# EAGLE design Protoboard (EAGLE 6.5.0)
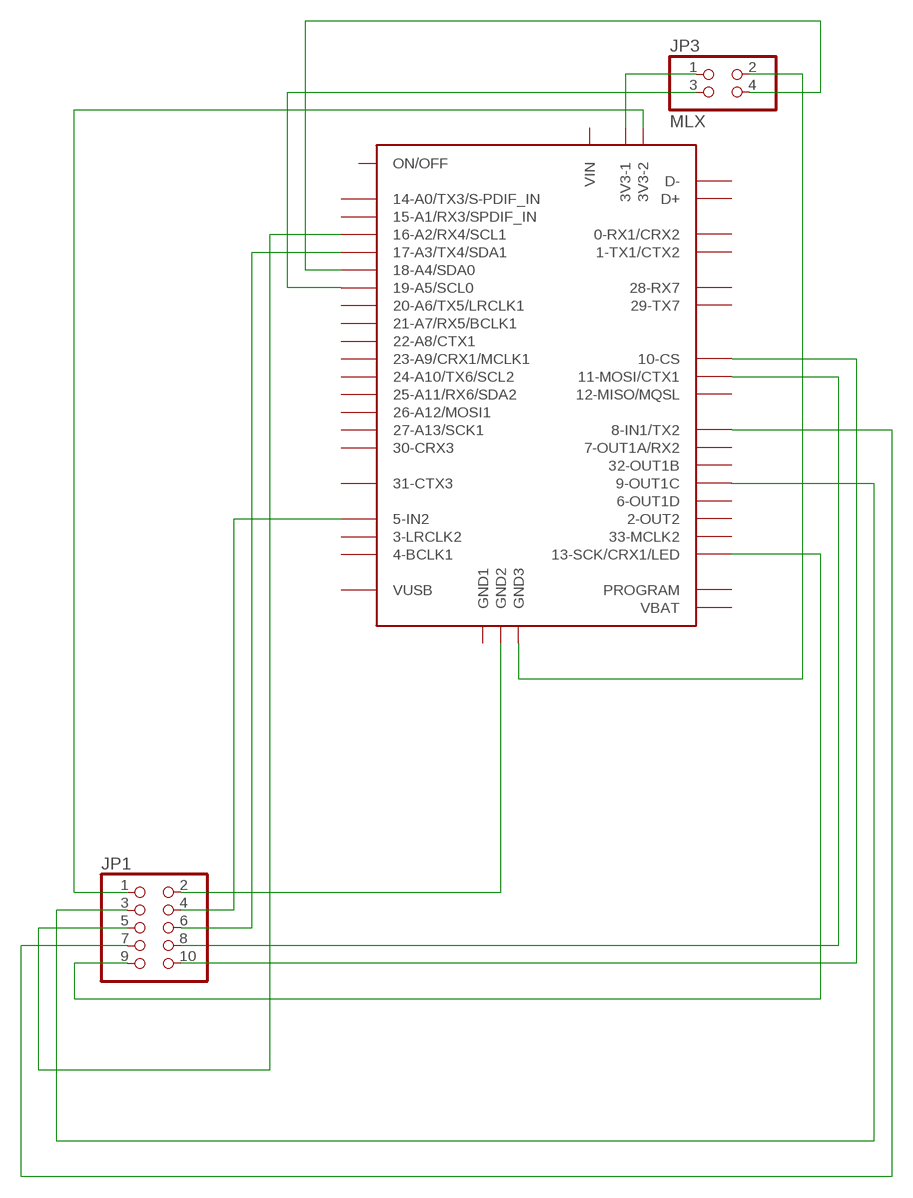
[diagram p0: schematic, sheet 1]

## Parts
JP1  PINHD-2X5  [2X05]
JP3  MLX  PINHD-2X2  [2X02]
U$1  TEENSY40  [TEENSY40]

## Nets
N$1: JP1.2 U$1.GND2
N$2: JP1.1 U$1.3V3-2
N$3: JP3.1 U$1.3V3-1
N$4: JP1.9 U$1.13-SCK/CRX1/LED
N$5: JP3.2 U$1.GND3
N$6: JP1.7 U$1.8-TX2/IN1(8-IN1/TX2)
N$7: JP1.5 U$1.16-A2/RX4/SCL1
N$8: JP1.6 U$1.17-A3/TX4/SDA1
N$10: JP1.4 U$1.5-IN2
N$11: JP1.8 U$1.11-MOSI/CTX1
N$12: JP1.10 U$1.10-CS/MQSR(10-CS)
N$13: JP3.4 U$1.18-A4/SDA0
N$14: JP3.3 U$1.19-A5/SCL0
N$15: JP1.3 U$1.9-OUT1C
Unconnected: U$1.0-RX1(0-RX1/CRX2) U$1.1-TX1(1-TX1/CTX2) U$1.2-OUT2 U$1.3-LRCLK2 U$1.4-BCLK2(4-BCLK1) U$1.6-OUT1D U$1.7-RX2/OUT1A(7-OUT1A/RX2) U$1.12-MIO/MQSL(12-MISO/MQSL) U$1.14-A0/TX3/S-PFI_OUT(14-A0/TX3/S-PDIF_IN) U$1.15-A1/RX3/S-PDIF_IN(15-A1/RX3/SPDIF_IN) U$1.20-A6/TX5/LRCLK1 U$1.21-A7/RX5/BCLK1 U$1.22-A8/CTX1 U$1.23-A9/CRX1/CCLK1(23-A9/CRX1/MCLK1) U$1.24-A10/TX6/SCL2 U$1.25-A11/SDA2(25-A11/RX6/SDA2) U$1.26-A12/MOSI1 U$1.27-A13/SCK1 U$1.28-RX7 U$1.29-TX7 U$1.30-CRX3 U$1.31-CTX3 U$1.32-OUTB1(32-OUT1B) U$1.33-MCLK2 U$1.D+ U$1.D- U$1.GND1 U$1.ON/OFF U$1.PROGRAM U$1.VBAT U$1.VIN U$1.VUSB

## Library data of the parts
JP1 = pinhead:PINHD-2X5: PIN HEADER
JP3 = pinhead:PINHD-2X2: PIN HEADER
U$1 = teensy:TEENSY40: Teensy 4.0 device including POGO pins for pins 24 - 33, but not yet pins for D+ and D-. Symbol layout is what works for me and may not suite everyone... that can be added or additional symbols can be created to be used in a modilied davie name.

## Board
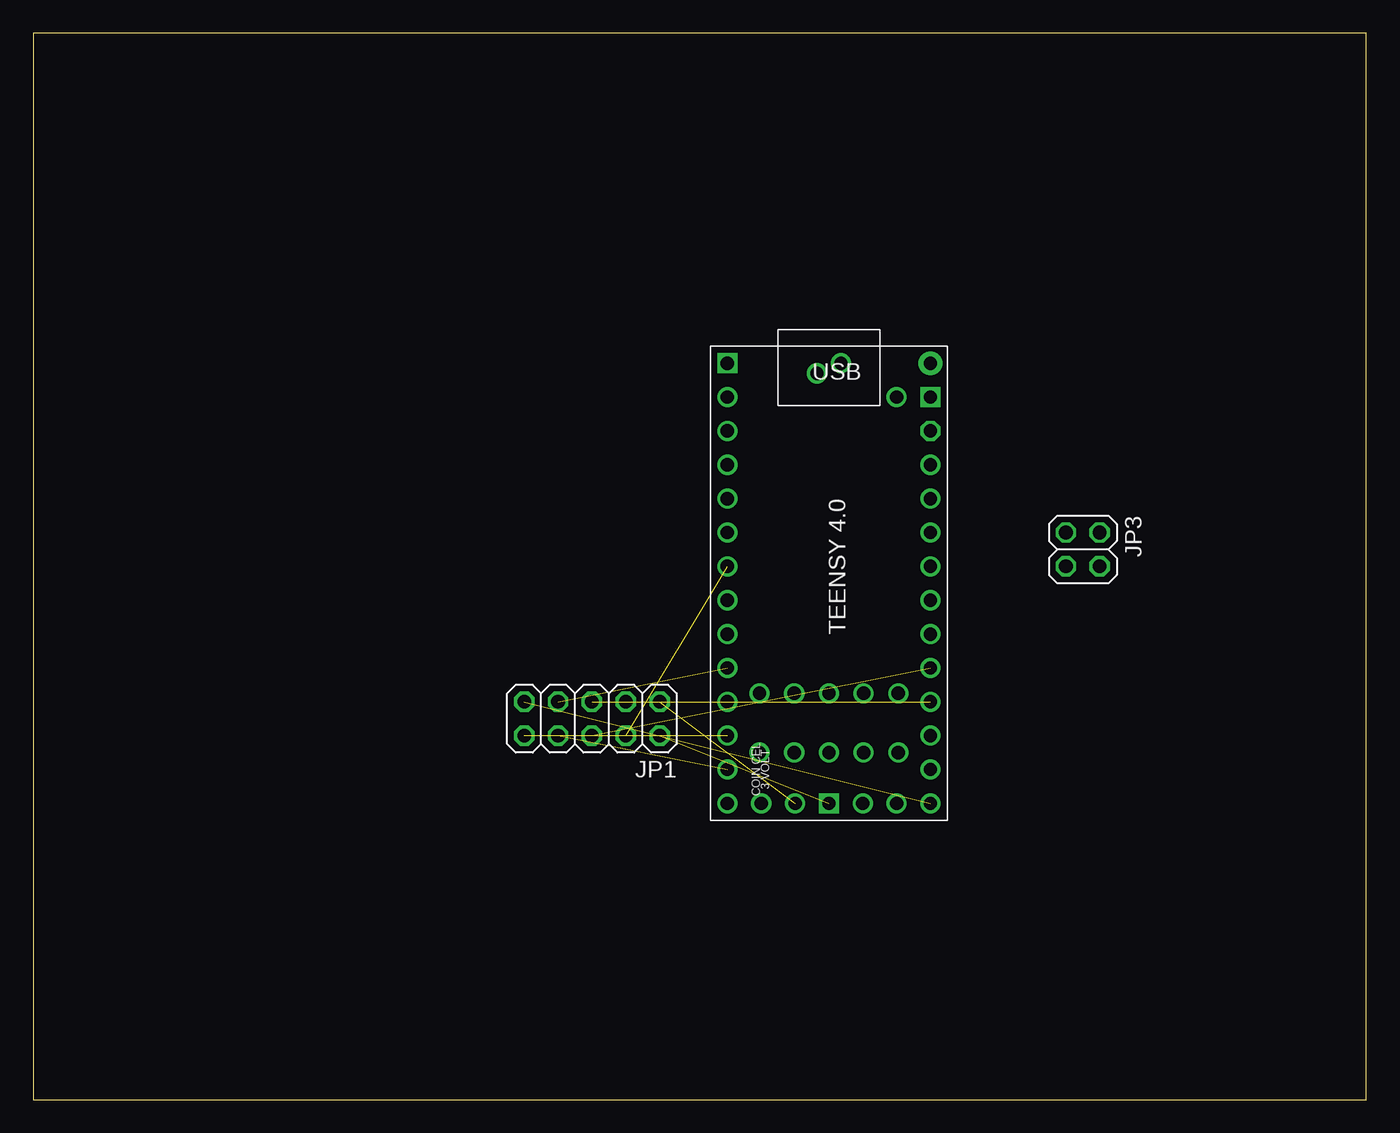
[diagram p1: board, top side]
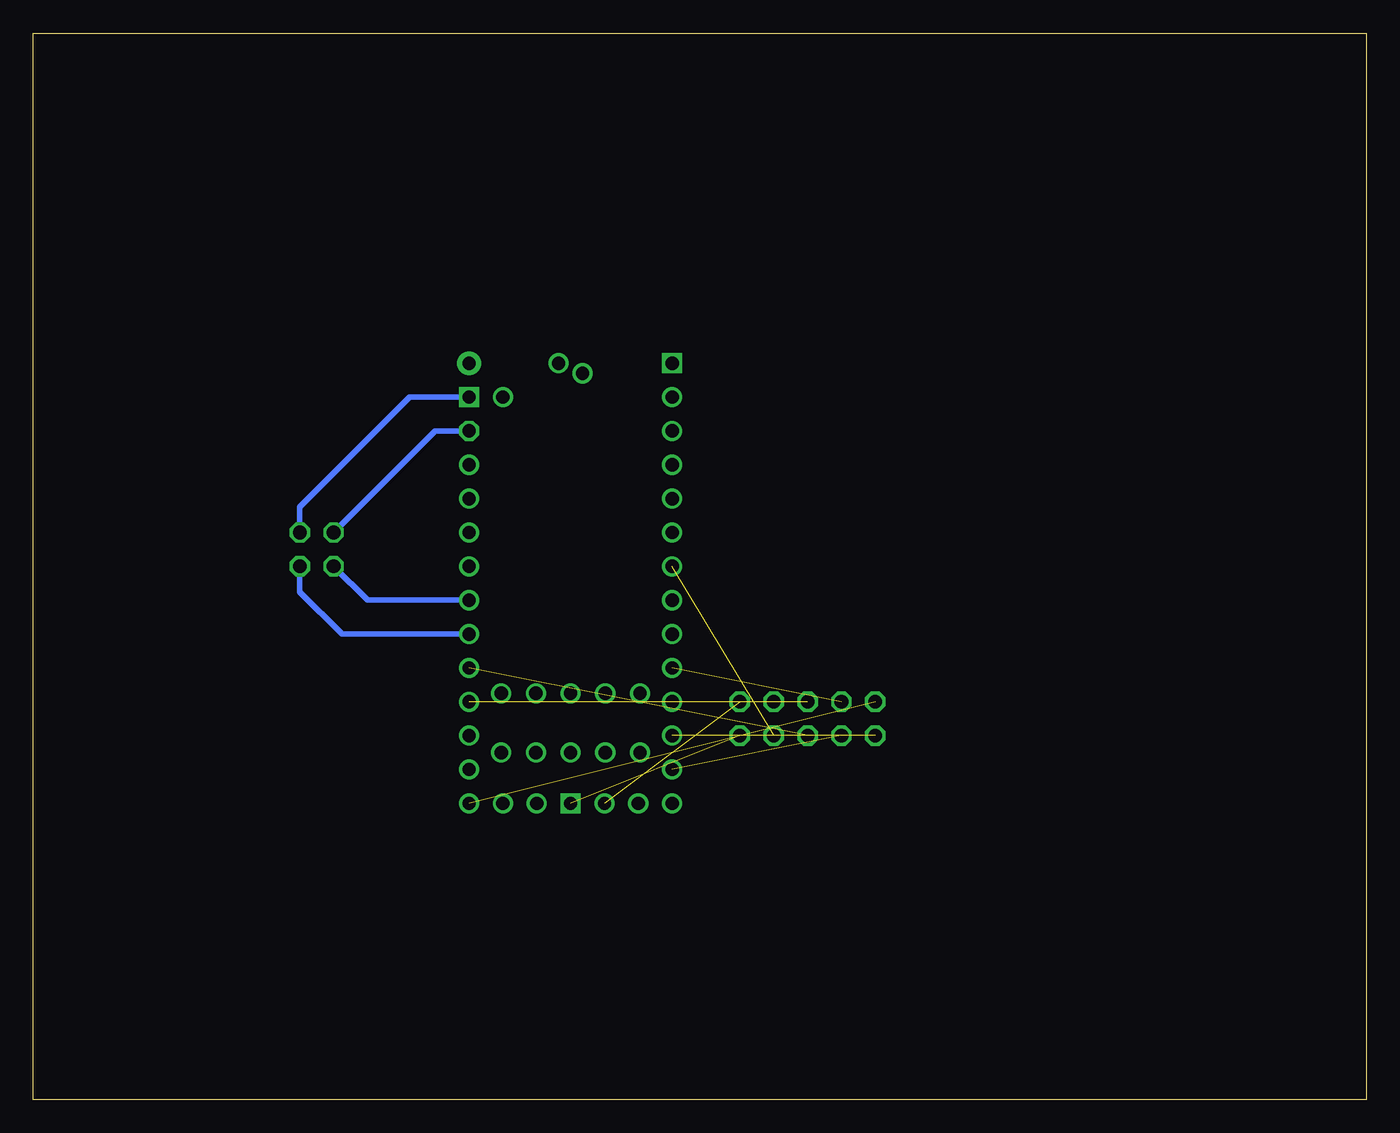
[diagram p2: board, bottom side, seen from below]

Size 100 x 80 mm. Coordinates in mm from the lower left corner, seen from the top.
Outline: 0,0 100,0 100,80 0,80 0,0
Copper layers (1*16): Top 0.035mm / dielectric 1.5mm / Bottom 0.035mm
Design rules "default": minimum track width 10mil, minimum drill 24mil, track to track 8mil, track to pad 8mil, pad to pad 8mil, via to via 8mil, smd to smd 8mil, copper to edge 40mil, drill to drill 8mil, minimum pad ring 10mil, minimum via ring 8mil, stop-mask expansion 4mil, vias tented up to drill 0mil, thermal gap 10mil

### Footprints (pad centres in the part's own frame; a part is rotated, then mirrored left to right if it is on the bottom)
2X05 = drill 1.016 octagon: 1 -5.08,-1.27; 2 -5.08,1.27; 3 -2.54,-1.27; 4 -2.54,1.27; 5 0,-1.27; 6 0,1.27; 7 2.54,-1.27; 8 2.54,1.27; 9 5.08,-1.27; 10 5.08,1.27
2X02 = drill 1.016 octagon: 1 -1.27,-1.27; 2 -1.27,1.27; 3 1.27,-1.27; 4 1.27,1.27
TEENSY40 = drill 1: 0-RX1 -13.97,-7.62; 1-TX1 -11.43,-7.62; 2-OUT2 -8.89,-7.62; 3-LRCLK2 -6.35,-7.62; 3V3-2 16.51,-2.54; 4-BCLK2 -3.81,-7.62; 5-IN2 -1.27,-7.62; 6-OUT1D 1.27,-7.62; 7-RX2/OUT1A 3.81,-7.62; 8-TX2/IN1 6.35,-7.62; 9-OUT1C 8.89,-7.62; 10-CS/MQSR 11.43,-7.62; 11-MOSI/CTX1 13.97,-7.62; 12-MIO/MQSL 16.51,-7.62; 13-SCK/CRX1/LED 16.51,7.62; 14-A0/TX3/S-PFI_OUT 13.97,7.62; 15-A1/RX3/S-PDIF_IN 11.43,7.62; 16-A2/RX4/SCL1 8.89,7.62; 17-A3/TX4/SDA1 6.35,7.62; 18-A4/SDA0 3.81,7.62; 19-A5/SCL0 1.27,7.62; 20-A6/TX5/LRCLK1 -1.27,7.62; 21-A7/RX5/BCLK1 -3.81,7.62; 22-A8/CTX1 -6.35,7.62; 23-A9/CRX1/CCLK1 -8.89,7.62; 24-A10/TX6/SCL2 12.7,5.207; 25-A11/SDA2 8.255,5.207; 26-A12/MOSI1 12.7,2.603; 27-A13/SCK1 8.255,2.603; 28-RX7 12.7,0; 29-TX7 8.255,0; 30-CRX3 12.7,-2.603; 31-CTX3 8.255,-2.603; 32-OUTB1 12.7,-5.207; 33-MCLK2 8.255,-5.207; D+ -15.75,-0.9; D- -16.51,0.9; ON/OFF 16.51,5.08; PROGRAM 16.51,2.54; VBAT 16.51,-5.08; VUSB -13.97,5.08 | drill 1 octagon: 3V3-1 -11.43,7.62 | drill 1 square: GND1 -16.51,-7.62; GND2 16.51,0; GND3 -13.97,7.62 | drill 1 pad 1.778: VIN -16.51,7.62

### Placement (x,y rotation side)
JP1  41.91,28.57 180 top
JP3  78.74,41.27 270 top
U$1  59.69,38.73 270 top

### Tracks (layer width: path | path; a pad name or v marks a point on that pad's centre or on a via)
N$1  (1 unrouted)
N$2  (1 unrouted)
N$3
  Bottom 0.406: U$1.3V3-1 69.85,50.16 JP3.1
N$4  (1 unrouted)
N$5
  Bottom 0.406: U$1.GND3 71.75,52.7 80.01,44.45 JP3.2
N$6  (1 unrouted)
N$7  (1 unrouted)
N$8  (1 unrouted)
N$10  (1 unrouted)
N$11  (1 unrouted)
N$12  (1 unrouted)
N$13
  Bottom 0.406: U$1.18-A4/SDA0 76.83,34.92 80.01,38.1 JP3.4
N$14
  Bottom 0.406: U$1.19-A5/SCL0 74.93,37.47 JP3.3
N$15  (1 unrouted)